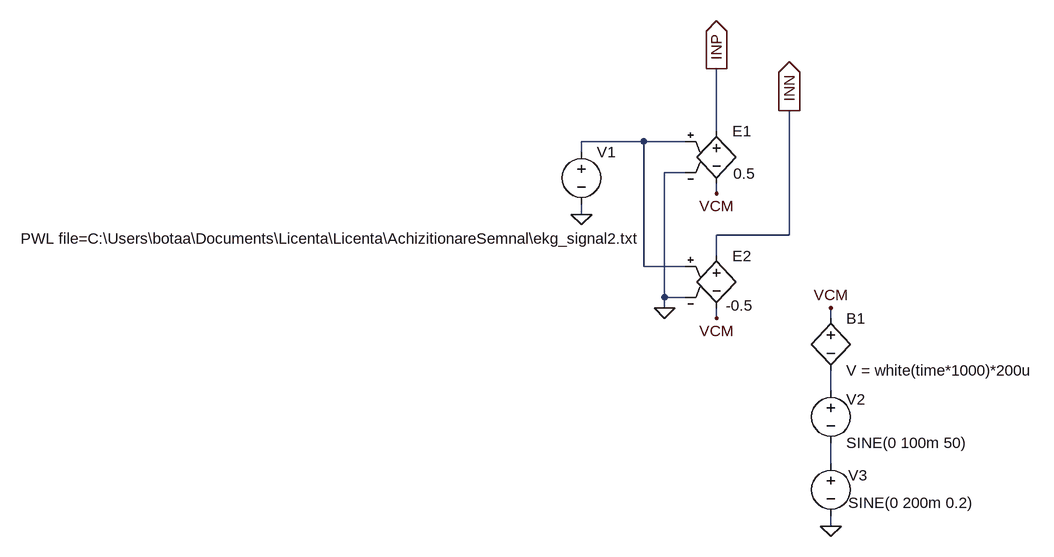
[diagram p0: schematic Draft2.asc]
Draft2.asc, the LTspice schematic file:
Version 4.1
SHEET 1 880 680
WIRE 240 -160 240 -256
WIRE 128 -144 32 -144
WIRE 192 -144 128 -144
WIRE 32 -128 32 -144
WIRE 192 -96 160 -96
WIRE 240 -64 240 -80
WIRE 32 -32 32 -48
WIRE 352 0 352 -192
WIRE 352 0 240 0
WIRE 240 32 240 0
WIRE 128 48 128 -144
WIRE 192 48 128 48
WIRE 160 96 160 -96
WIRE 192 96 160 96
WIRE 160 112 160 96
WIRE 240 128 240 112
WIRE 416 128 416 112
WIRE 416 240 416 208
WIRE 416 352 416 320
WIRE 416 448 416 432
FLAG 32 -32 0
FLAG 160 112 0
FLAG 416 112 VCM
FLAG 240 -64 VCM
FLAG 240 128 VCM
FLAG 416 448 0
FLAG 240 -256 INP
IOPIN 240 -256 Out
FLAG 352 -192 INN
IOPIN 352 -192 Out
SYMBOL e 240 -176 R0
WINDOW 3 26 81 Left 2
SYMATTR Value 0.5
SYMATTR InstName E1
SYMBOL e 240 16 R0
WINDOW 3 14 92 Left 2
SYMATTR Value -0.5
SYMATTR InstName E2
SYMBOL voltage 32 -144 R0
WINDOW 3 -863 149 Left 2
WINDOW 123 0 0 Left 0
WINDOW 39 0 0 Left 0
SYMATTR Value PWL file=C:\Users\botaa\Documents\Licenta\Licenta\AchizitionareSemnal\ekg_signal2.txt
SYMATTR InstName V1
SYMBOL voltage 416 224 R0
WINDOW 0 24 29 Left 2
SYMATTR InstName V2
SYMATTR Value SINE(0 100m 50)
SYMBOL voltage 416 336 R0
WINDOW 0 27 34 Left 2
WINDOW 3 27 76 Left 2
WINDOW 123 0 0 Left 0
WINDOW 39 0 0 Left 0
SYMATTR InstName V3
SYMATTR Value SINE(0 200m 0.2)
SYMBOL bv 416 112 R0
SYMATTR InstName B1
SYMATTR Value V = white(time*1000)*200u

The netlist it stands for:
* Draft2.asc
E1 INP VCM N001 0 0.5
E2 INN VCM N001 0 -0.5
V1 N001 0 PWL file=C:\Users\botaa\Documents\Licenta\Licenta\AchizitionareSemnal\ekg_signal2.txt
V2 N002 N003 SINE(0 100m 50)
V3 N003 0 SINE(0 200m 0.2)
B1 VCM N002 V = white(time*1000)*200u
.backanno
.end